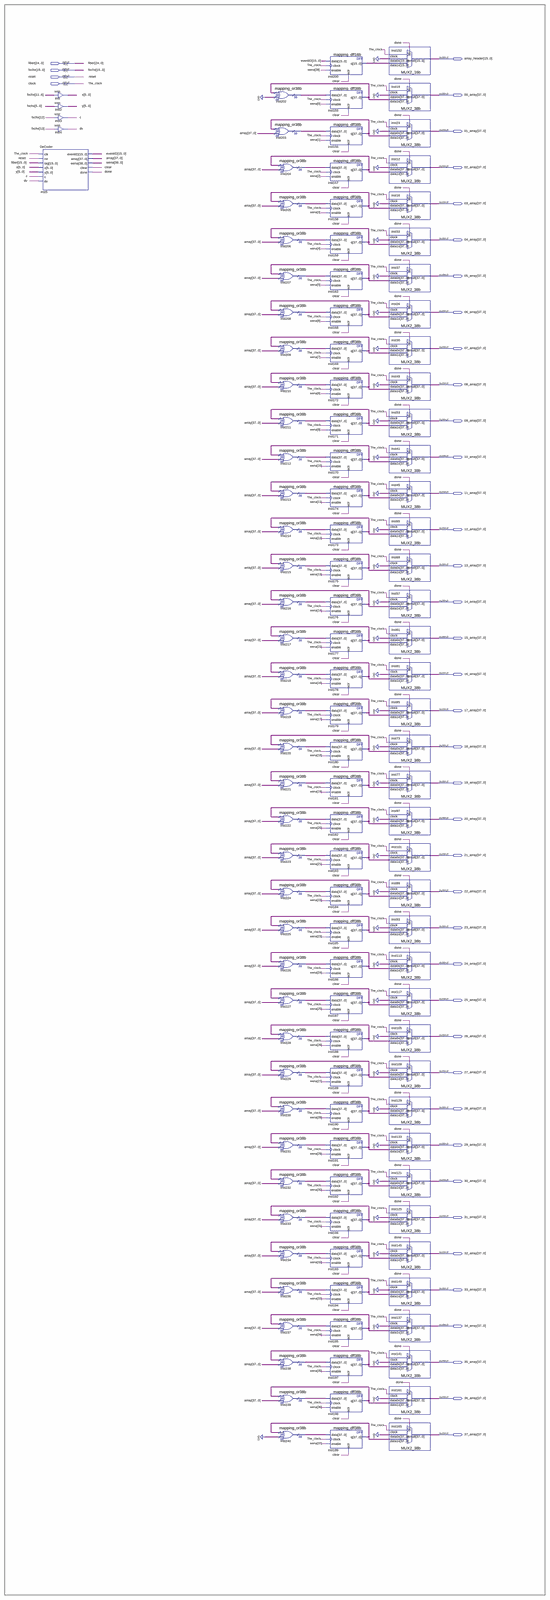
[diagram p0: schematic sheet, whole]
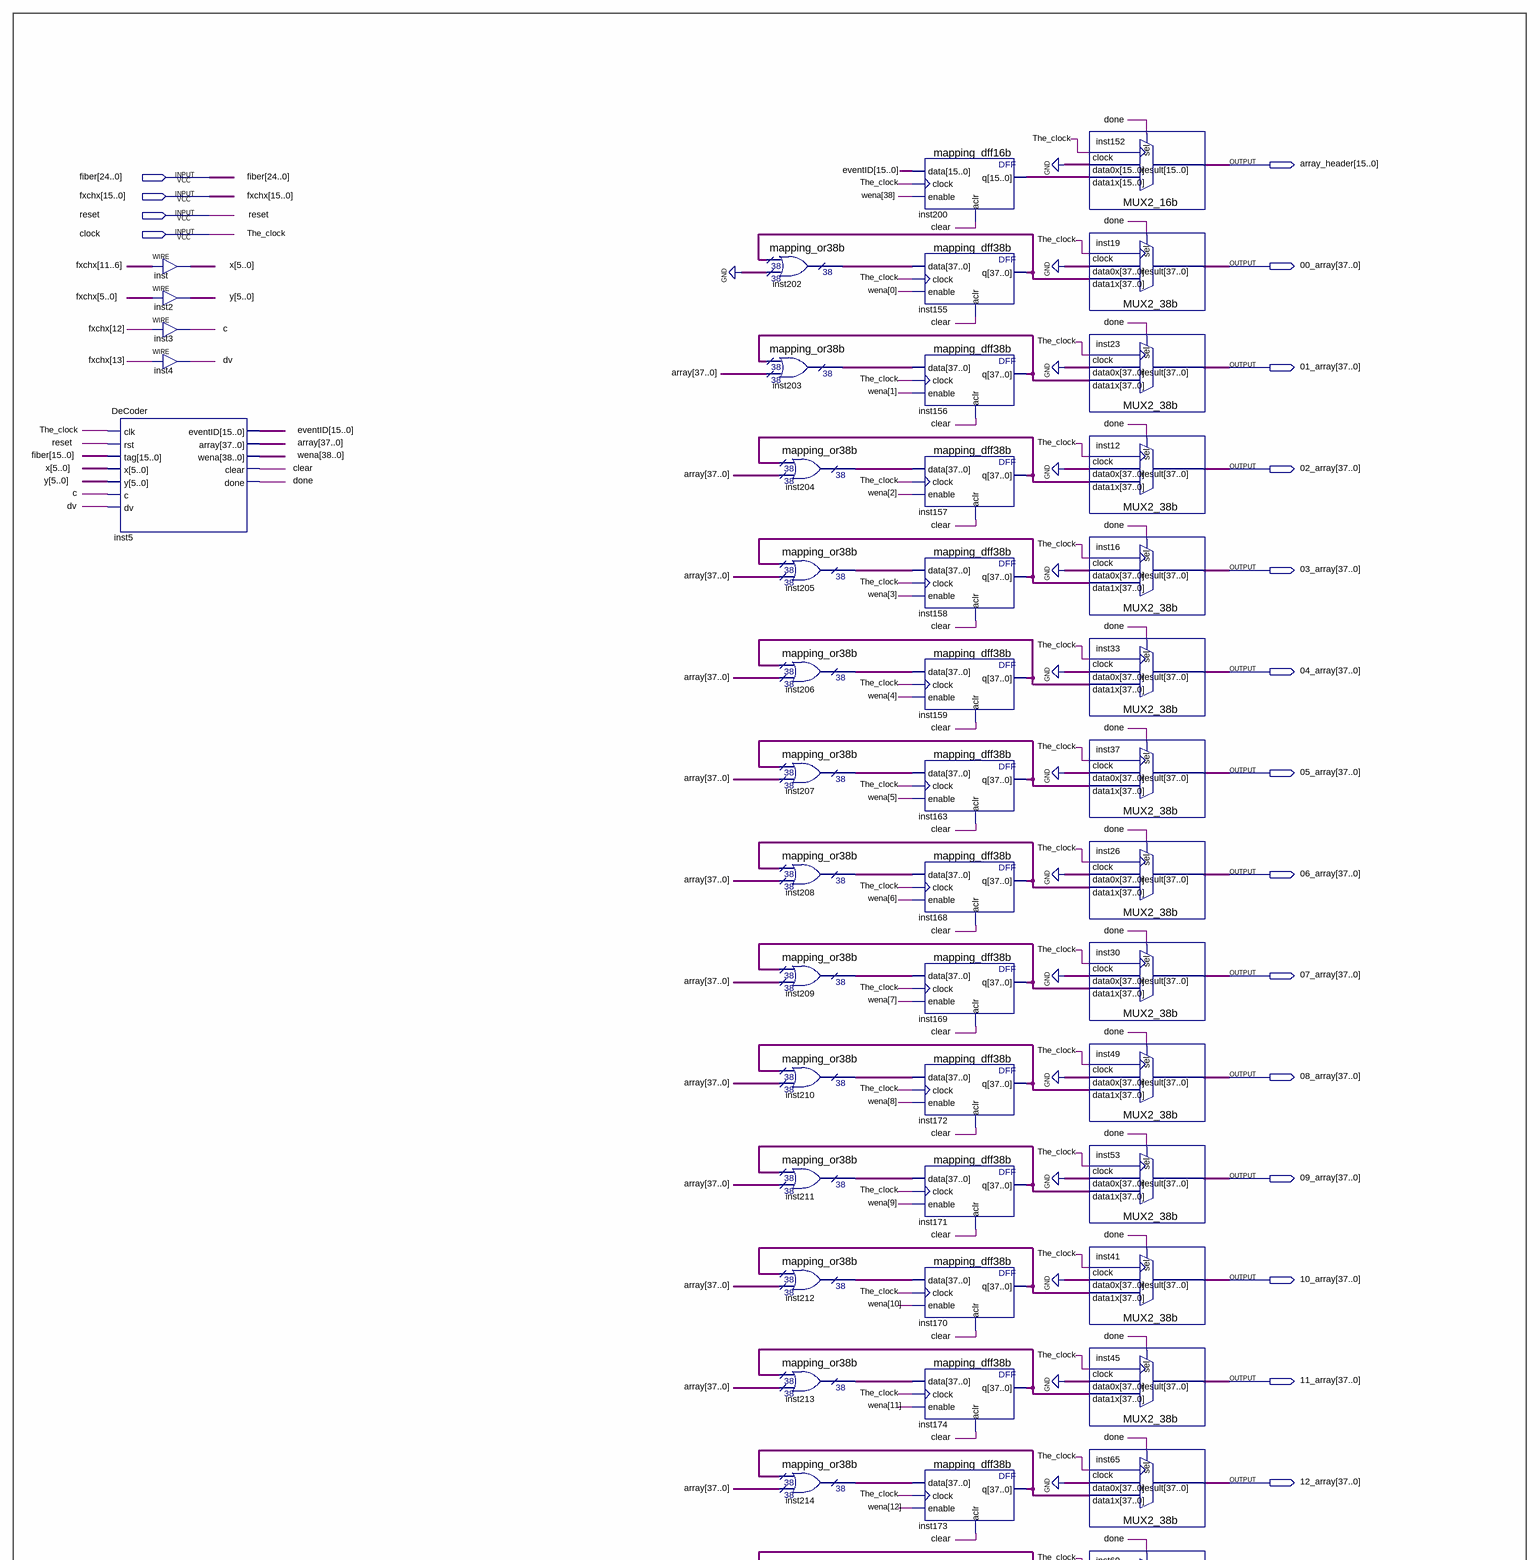
[diagram p1: schematic sheet, upper part]
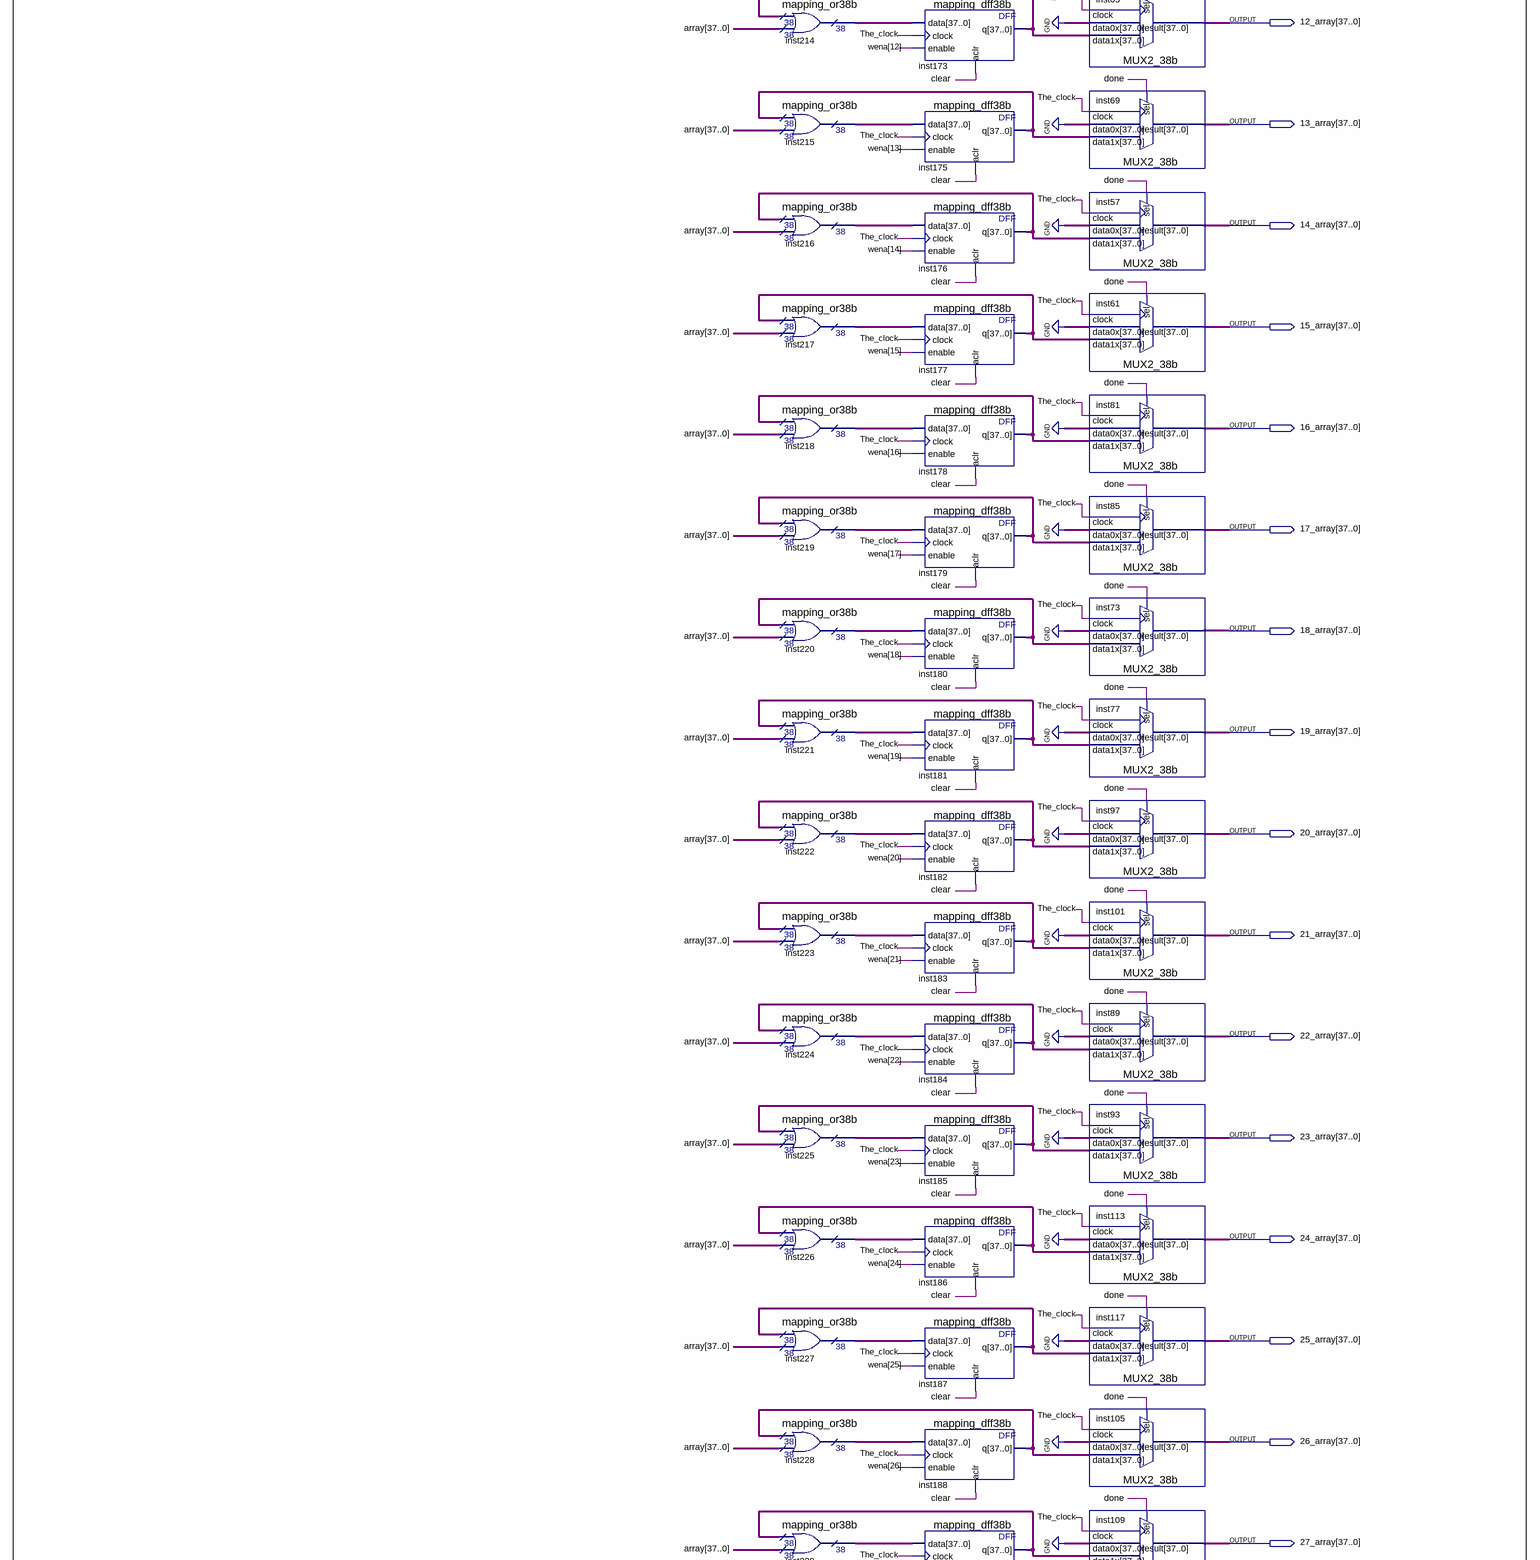
[diagram p2: schematic sheet, middle part]
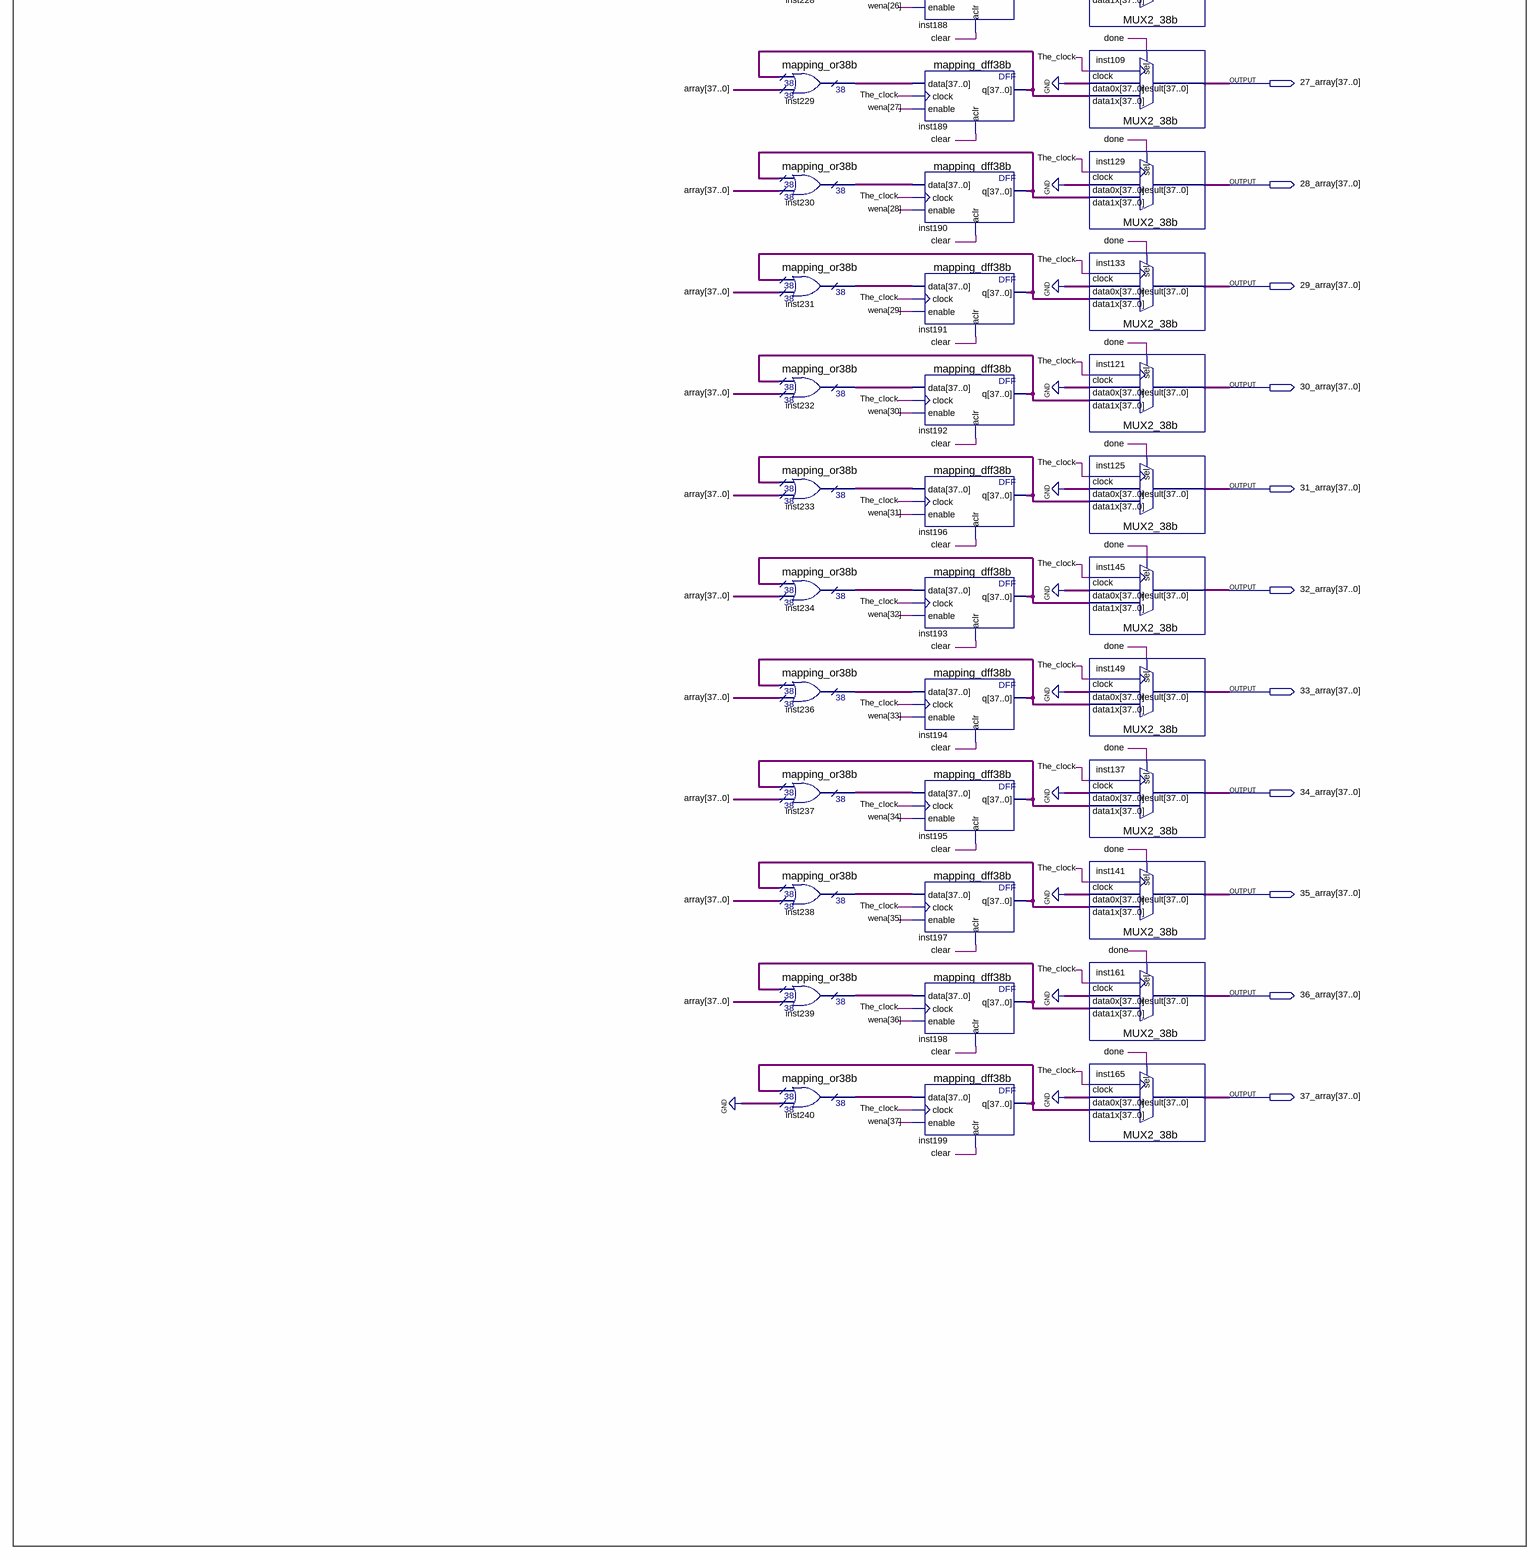
[diagram p3: schematic sheet, lower part]
// Quartus schematic mapping.bdf as structural Verilog: 121 symbols, 43 pins
module mapping (
  input  [24:0] fiber,
  input  [15:0] fxchx,
  input  reset,
  input  clock,
  output [15:0] array_header,
  output [37:0] \00_array ,
  output [37:0] \01_array ,
  output [37:0] \02_array ,
  output [37:0] \03_array ,
  output [37:0] \04_array ,
  output [37:0] \05_array ,
  output [37:0] \06_array ,
  output [37:0] \07_array ,
  output [37:0] \08_array ,
  output [37:0] \09_array ,
  output [37:0] \10_array ,
  output [37:0] \11_array ,
  output [37:0] \12_array ,
  output [37:0] \13_array ,
  output [37:0] \14_array ,
  output [37:0] \15_array ,
  output [37:0] \16_array ,
  output [37:0] \17_array ,
  output [37:0] \18_array ,
  output [37:0] \19_array ,
  output [37:0] \20_array ,
  output [37:0] \21_array ,
  output [37:0] \22_array ,
  output [37:0] \23_array ,
  output [37:0] \24_array ,
  output [37:0] \25_array ,
  output [37:0] \26_array ,
  output [37:0] \27_array ,
  output [37:0] \28_array ,
  output [37:0] \29_array ,
  output [37:0] \30_array ,
  output [37:0] \31_array ,
  output [37:0] \32_array ,
  output [37:0] \33_array ,
  output [37:0] \34_array ,
  output [37:0] \35_array ,
  output [37:0] \36_array ,
  output [37:0] \37_array 
);

  wire c, clear, done, dv;
  wire [5:0] x, y;
  wire [15:0] eventID, inst200_q;
  wire [37:0] array, inst155_q, inst156_q, inst157_q, inst158_q, inst159_q, inst163_q, inst168_q, inst169_q,
       inst170_q, inst171_q, inst172_q, inst173_q, inst174_q, inst175_q, inst176_q, inst177_q, inst178_q,
       inst179_q, inst180_q, inst181_q, inst182_q, inst183_q, inst184_q, inst185_q, inst186_q, inst187_q,
       inst188_q, inst189_q, inst190_q, inst191_q, inst192_q, inst193_q, inst194_q, inst195_q, inst196_q,
       inst197_q, inst198_q, inst199_q, inst202_result, inst203_result, inst204_result, inst205_result,
       inst206_result, inst207_result, inst208_result, inst209_result, inst210_result, inst211_result,
       inst212_result, inst213_result, inst214_result, inst215_result, inst216_result, inst217_result,
       inst218_result, inst219_result, inst220_result, inst221_result, inst222_result, inst223_result,
       inst224_result, inst225_result, inst226_result, inst227_result, inst228_result, inst229_result,
       inst230_result, inst231_result, inst232_result, inst233_result, inst234_result, inst236_result,
       inst237_result, inst238_result, inst239_result, inst240_result;
  wire [38:0] wena;

  DeCoder inst5 (
    .clk(clock), .rst(reset), .tag(fiber[15:0]), .x(x), .y(y), .c(c), .dv(dv), .eventID(eventID),
    .array(array), .wena(wena), .clear(clear), .done(done));
  assign x = fxchx[11:6];  // WIRE inst
  assign y = fxchx[5:0];  // WIRE inst2
  assign c = fxchx[12];  // WIRE inst3
  assign dv = fxchx[13];  // WIRE inst4
  mapping_or38b inst202 (.data0x(inst155_q), .data1x({38{1'b0}}), .result(inst202_result));
  mapping_or38b inst203 (.data0x(inst156_q), .data1x(array), .result(inst203_result));
  mapping_or38b inst204 (.data0x(inst157_q), .data1x(array), .result(inst204_result));
  mapping_or38b inst205 (.data0x(inst158_q), .data1x(array), .result(inst205_result));
  mapping_or38b inst206 (.data0x(inst159_q), .data1x(array), .result(inst206_result));
  mapping_or38b inst207 (.data0x(inst163_q), .data1x(array), .result(inst207_result));
  mapping_or38b inst208 (.data0x(inst168_q), .data1x(array), .result(inst208_result));
  mapping_or38b inst209 (.data0x(inst169_q), .data1x(array), .result(inst209_result));
  mapping_or38b inst210 (.data0x(inst172_q), .data1x(array), .result(inst210_result));
  mapping_or38b inst211 (.data0x(inst171_q), .data1x(array), .result(inst211_result));
  mapping_or38b inst212 (.data0x(inst170_q), .data1x(array), .result(inst212_result));
  mapping_or38b inst213 (.data0x(inst174_q), .data1x(array), .result(inst213_result));
  mapping_or38b inst214 (.data0x(inst173_q), .data1x(array), .result(inst214_result));
  mapping_or38b inst215 (.data0x(inst175_q), .data1x(array), .result(inst215_result));
  mapping_or38b inst216 (.data0x(inst176_q), .data1x(array), .result(inst216_result));
  mapping_or38b inst217 (.data0x(inst177_q), .data1x(array), .result(inst217_result));
  mapping_or38b inst218 (.data0x(inst178_q), .data1x(array), .result(inst218_result));
  mapping_or38b inst219 (.data0x(inst179_q), .data1x(array), .result(inst219_result));
  mapping_or38b inst220 (.data0x(inst180_q), .data1x(array), .result(inst220_result));
  mapping_or38b inst221 (.data0x(inst181_q), .data1x(array), .result(inst221_result));
  mapping_or38b inst222 (.data0x(inst182_q), .data1x(array), .result(inst222_result));
  mapping_or38b inst223 (.data0x(inst183_q), .data1x(array), .result(inst223_result));
  mapping_or38b inst224 (.data0x(inst184_q), .data1x(array), .result(inst224_result));
  mapping_or38b inst225 (.data0x(inst185_q), .data1x(array), .result(inst225_result));
  mapping_or38b inst226 (.data0x(inst186_q), .data1x(array), .result(inst226_result));
  mapping_or38b inst227 (.data0x(inst187_q), .data1x(array), .result(inst227_result));
  mapping_or38b inst228 (.data0x(inst188_q), .data1x(array), .result(inst228_result));
  mapping_or38b inst229 (.data0x(inst189_q), .data1x(array), .result(inst229_result));
  mapping_or38b inst230 (.data0x(inst190_q), .data1x(array), .result(inst230_result));
  mapping_or38b inst231 (.data0x(inst191_q), .data1x(array), .result(inst231_result));
  mapping_or38b inst232 (.data0x(inst192_q), .data1x(array), .result(inst232_result));
  mapping_or38b inst233 (.data0x(inst196_q), .data1x(array), .result(inst233_result));
  mapping_or38b inst234 (.data0x(inst193_q), .data1x(array), .result(inst234_result));
  mapping_or38b inst236 (.data0x(inst194_q), .data1x(array), .result(inst236_result));
  mapping_or38b inst237 (.data0x(inst195_q), .data1x(array), .result(inst237_result));
  mapping_or38b inst238 (.data0x(inst197_q), .data1x(array), .result(inst238_result));
  mapping_or38b inst239 (.data0x(inst198_q), .data1x(array), .result(inst239_result));
  mapping_or38b inst240 (.data0x(inst199_q), .data1x({38{1'b0}}), .result(inst240_result));
  mapping_dff16b inst200 (.data(eventID), .clock(clock), .enable(wena[38]), .aclr(clear), .q(inst200_q));
  mapping_dff38b inst155 (.data(inst202_result), .clock(clock), .enable(wena[0]), .aclr(clear), .q(inst155_q));
  mapping_dff38b inst156 (.data(inst203_result), .clock(clock), .enable(wena[1]), .aclr(clear), .q(inst156_q));
  mapping_dff38b inst157 (.data(inst204_result), .clock(clock), .enable(wena[2]), .aclr(clear), .q(inst157_q));
  mapping_dff38b inst158 (.data(inst205_result), .clock(clock), .enable(wena[3]), .aclr(clear), .q(inst158_q));
  mapping_dff38b inst159 (.data(inst206_result), .clock(clock), .enable(wena[4]), .aclr(clear), .q(inst159_q));
  mapping_dff38b inst163 (.data(inst207_result), .clock(clock), .enable(wena[5]), .aclr(clear), .q(inst163_q));
  mapping_dff38b inst168 (.data(inst208_result), .clock(clock), .enable(wena[6]), .aclr(clear), .q(inst168_q));
  mapping_dff38b inst169 (.data(inst209_result), .clock(clock), .enable(wena[7]), .aclr(clear), .q(inst169_q));
  mapping_dff38b inst172 (.data(inst210_result), .clock(clock), .enable(wena[8]), .aclr(clear), .q(inst172_q));
  mapping_dff38b inst171 (.data(inst211_result), .clock(clock), .enable(wena[9]), .aclr(clear), .q(inst171_q));
  mapping_dff38b inst170 (.data(inst212_result), .clock(clock), .enable(wena[10]), .aclr(clear), .q(inst170_q));
  mapping_dff38b inst174 (.data(inst213_result), .clock(clock), .enable(wena[11]), .aclr(clear), .q(inst174_q));
  mapping_dff38b inst173 (.data(inst214_result), .clock(clock), .enable(wena[12]), .aclr(clear), .q(inst173_q));
  mapping_dff38b inst175 (.data(inst215_result), .clock(clock), .enable(wena[13]), .aclr(clear), .q(inst175_q));
  mapping_dff38b inst176 (.data(inst216_result), .clock(clock), .enable(wena[14]), .aclr(clear), .q(inst176_q));
  mapping_dff38b inst177 (.data(inst217_result), .clock(clock), .enable(wena[15]), .aclr(clear), .q(inst177_q));
  mapping_dff38b inst178 (.data(inst218_result), .clock(clock), .enable(wena[16]), .aclr(clear), .q(inst178_q));
  mapping_dff38b inst179 (.data(inst219_result), .clock(clock), .enable(wena[17]), .aclr(clear), .q(inst179_q));
  mapping_dff38b inst180 (.data(inst220_result), .clock(clock), .enable(wena[18]), .aclr(clear), .q(inst180_q));
  mapping_dff38b inst181 (.data(inst221_result), .clock(clock), .enable(wena[19]), .aclr(clear), .q(inst181_q));
  mapping_dff38b inst182 (.data(inst222_result), .clock(clock), .enable(wena[20]), .aclr(clear), .q(inst182_q));
  mapping_dff38b inst183 (.data(inst223_result), .clock(clock), .enable(wena[21]), .aclr(clear), .q(inst183_q));
  mapping_dff38b inst184 (.data(inst224_result), .clock(clock), .enable(wena[22]), .aclr(clear), .q(inst184_q));
  mapping_dff38b inst185 (.data(inst225_result), .clock(clock), .enable(wena[23]), .aclr(clear), .q(inst185_q));
  mapping_dff38b inst186 (.data(inst226_result), .clock(clock), .enable(wena[24]), .aclr(clear), .q(inst186_q));
  mapping_dff38b inst187 (.data(inst227_result), .clock(clock), .enable(wena[25]), .aclr(clear), .q(inst187_q));
  mapping_dff38b inst188 (.data(inst228_result), .clock(clock), .enable(wena[26]), .aclr(clear), .q(inst188_q));
  mapping_dff38b inst189 (.data(inst229_result), .clock(clock), .enable(wena[27]), .aclr(clear), .q(inst189_q));
  mapping_dff38b inst190 (.data(inst230_result), .clock(clock), .enable(wena[28]), .aclr(clear), .q(inst190_q));
  mapping_dff38b inst191 (.data(inst231_result), .clock(clock), .enable(wena[29]), .aclr(clear), .q(inst191_q));
  mapping_dff38b inst192 (.data(inst232_result), .clock(clock), .enable(wena[30]), .aclr(clear), .q(inst192_q));
  mapping_dff38b inst196 (.data(inst233_result), .clock(clock), .enable(wena[31]), .aclr(clear), .q(inst196_q));
  mapping_dff38b inst193 (.data(inst234_result), .clock(clock), .enable(wena[32]), .aclr(clear), .q(inst193_q));
  mapping_dff38b inst194 (.data(inst236_result), .clock(clock), .enable(wena[33]), .aclr(clear), .q(inst194_q));
  mapping_dff38b inst195 (.data(inst237_result), .clock(clock), .enable(wena[34]), .aclr(clear), .q(inst195_q));
  mapping_dff38b inst197 (.data(inst238_result), .clock(clock), .enable(wena[35]), .aclr(clear), .q(inst197_q));
  mapping_dff38b inst198 (.data(inst239_result), .clock(clock), .enable(wena[36]), .aclr(clear), .q(inst198_q));
  mapping_dff38b inst199 (.data(inst240_result), .clock(clock), .enable(wena[37]), .aclr(clear), .q(inst199_q));
  MUX2_16b inst152 (.data1x(inst200_q), .data0x({16{1'b0}}), .clock(clock), .sel(done), .result(array_header));
  MUX2_38b inst19 (.data1x(inst155_q), .data0x({38{1'b0}}), .clock(clock), .sel(done), .result(\00_array ));
  MUX2_38b inst23 (.data1x(inst156_q), .data0x({38{1'b0}}), .clock(clock), .sel(done), .result(\01_array ));
  MUX2_38b inst12 (.data1x(inst157_q), .data0x({38{1'b0}}), .clock(clock), .sel(done), .result(\02_array ));
  MUX2_38b inst16 (.data1x(inst158_q), .data0x({38{1'b0}}), .clock(clock), .sel(done), .result(\03_array ));
  MUX2_38b inst33 (.data1x(inst159_q), .data0x({38{1'b0}}), .clock(clock), .sel(done), .result(\04_array ));
  MUX2_38b inst37 (.data1x(inst163_q), .data0x({38{1'b0}}), .clock(clock), .sel(done), .result(\05_array ));
  MUX2_38b inst26 (.data1x(inst168_q), .data0x({38{1'b0}}), .clock(clock), .sel(done), .result(\06_array ));
  MUX2_38b inst30 (.data1x(inst169_q), .data0x({38{1'b0}}), .clock(clock), .sel(done), .result(\07_array ));
  MUX2_38b inst49 (.data1x(inst172_q), .data0x({38{1'b0}}), .clock(clock), .sel(done), .result(\08_array ));
  MUX2_38b inst53 (.data1x(inst171_q), .data0x({38{1'b0}}), .clock(clock), .sel(done), .result(\09_array ));
  MUX2_38b inst41 (.data1x(inst170_q), .data0x({38{1'b0}}), .clock(clock), .sel(done), .result(\10_array ));
  MUX2_38b inst45 (.data1x(inst174_q), .data0x({38{1'b0}}), .clock(clock), .sel(done), .result(\11_array ));
  MUX2_38b inst65 (.data1x(inst173_q), .data0x({38{1'b0}}), .clock(clock), .sel(done), .result(\12_array ));
  MUX2_38b inst69 (.data1x(inst175_q), .data0x({38{1'b0}}), .clock(clock), .sel(done), .result(\13_array ));
  MUX2_38b inst57 (.data1x(inst176_q), .data0x({38{1'b0}}), .clock(clock), .sel(done), .result(\14_array ));
  MUX2_38b inst61 (.data1x(inst177_q), .data0x({38{1'b0}}), .clock(clock), .sel(done), .result(\15_array ));
  MUX2_38b inst81 (.data1x(inst178_q), .data0x({38{1'b0}}), .clock(clock), .sel(done), .result(\16_array ));
  MUX2_38b inst85 (.data1x(inst179_q), .data0x({38{1'b0}}), .clock(clock), .sel(done), .result(\17_array ));
  MUX2_38b inst73 (.data1x(inst180_q), .data0x({38{1'b0}}), .clock(clock), .sel(done), .result(\18_array ));
  MUX2_38b inst77 (.data1x(inst181_q), .data0x({38{1'b0}}), .clock(clock), .sel(done), .result(\19_array ));
  MUX2_38b inst97 (.data1x(inst182_q), .data0x({38{1'b0}}), .clock(clock), .sel(done), .result(\20_array ));
  MUX2_38b inst101 (.data1x(inst183_q), .data0x({38{1'b0}}), .clock(clock), .sel(done), .result(\21_array ));
  MUX2_38b inst89 (.data1x(inst184_q), .data0x({38{1'b0}}), .clock(clock), .sel(done), .result(\22_array ));
  MUX2_38b inst93 (.data1x(inst185_q), .data0x({38{1'b0}}), .clock(clock), .sel(done), .result(\23_array ));
  MUX2_38b inst113 (.data1x(inst186_q), .data0x({38{1'b0}}), .clock(clock), .sel(done), .result(\24_array ));
  MUX2_38b inst117 (.data1x(inst187_q), .data0x({38{1'b0}}), .clock(clock), .sel(done), .result(\25_array ));
  MUX2_38b inst105 (.data1x(inst188_q), .data0x({38{1'b0}}), .clock(clock), .sel(done), .result(\26_array ));
  MUX2_38b inst109 (.data1x(inst189_q), .data0x({38{1'b0}}), .clock(clock), .sel(done), .result(\27_array ));
  MUX2_38b inst129 (.data1x(inst190_q), .data0x({38{1'b0}}), .clock(clock), .sel(done), .result(\28_array ));
  MUX2_38b inst133 (.data1x(inst191_q), .data0x({38{1'b0}}), .clock(clock), .sel(done), .result(\29_array ));
  MUX2_38b inst121 (.data1x(inst192_q), .data0x({38{1'b0}}), .clock(clock), .sel(done), .result(\30_array ));
  MUX2_38b inst125 (.data1x(inst196_q), .data0x({38{1'b0}}), .clock(clock), .sel(done), .result(\31_array ));
  MUX2_38b inst145 (.data1x(inst193_q), .data0x({38{1'b0}}), .clock(clock), .sel(done), .result(\32_array ));
  MUX2_38b inst149 (.data1x(inst194_q), .data0x({38{1'b0}}), .clock(clock), .sel(done), .result(\33_array ));
  MUX2_38b inst137 (.data1x(inst195_q), .data0x({38{1'b0}}), .clock(clock), .sel(done), .result(\34_array ));
  MUX2_38b inst141 (.data1x(inst197_q), .data0x({38{1'b0}}), .clock(clock), .sel(done), .result(\35_array ));
  MUX2_38b inst161 (.data1x(inst198_q), .data0x({38{1'b0}}), .clock(clock), .sel(done), .result(\36_array ));
  MUX2_38b inst165 (.data1x(inst199_q), .data0x({38{1'b0}}), .clock(clock), .sel(done), .result(\37_array ));

  // Other names for the same wires on the sheet: The_clock = clock
endmodule
